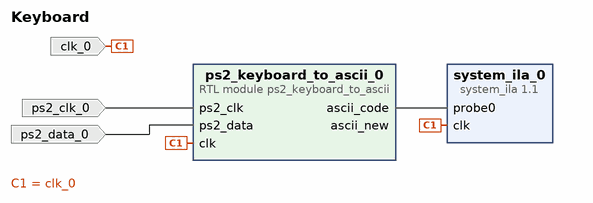
[diagram p0: block diagram of the top level]
# Vivado block design Keyboard, xc7z010clg400-1, Vivado 2019.1
create_bd_design Keyboard

create_bd_port -dir I -type clk clk_0
create_bd_port -dir I -type clk ps2_clk_0
create_bd_port -dir I ps2_data_0

create_bd_cell -type module -reference ps2_keyboard_to_ascii ps2_keyboard_to_ascii_0
create_bd_cell -type ip -vlnv xilinx.com:ip:system_ila:1.1 system_ila_0
set_property -dict {CONFIG.C_MON_TYPE NATIVE CONFIG.C_NUM_OF_PROBES 1 CONFIG.C_PROBE0_TYPE 0} [get_bd_cells system_ila_0]

# ---- connections ----

connect_bd_net -net ps2_clk_0_1 [get_bd_ports ps2_clk_0] [get_bd_pins ps2_keyboard_to_ascii_0/ps2_clk]
connect_bd_net -net ps2_data_0_1 [get_bd_ports ps2_data_0] [get_bd_pins ps2_keyboard_to_ascii_0/ps2_data]
connect_bd_net -net clk_0_1 [get_bd_ports clk_0] [get_bd_pins ps2_keyboard_to_ascii_0/clk] [get_bd_pins system_ila_0/clk]
# net ascii_new has one end: ps2_keyboard_to_ascii_0/ascii_new
connect_bd_net -net ascii_code [get_bd_pins ps2_keyboard_to_ascii_0/ascii_code] [get_bd_pins system_ila_0/probe0]
set_property HDL_ATTRIBUTE.DEBUG true [get_bd_nets ascii_code]
set_property HDL_ATTRIBUTE.MARK_DEBUG true [get_bd_nets ascii_code]

validate_bd_design
save_bd_design
